# Altium schematic sheet ADC_8CH.SchDoc: ADC + reference
size 420 x 297 mm; Author: G.K.; CompanyName: WUT; DrawnBy: G.K.; Organization: CERN; Address1: Warsaw Univeristy of Technology; Address2: Nowowiejska 15/19; DocumentNumber: 2; Revision: -; SheetNumber: 2; SheetTotal: 5; EDA_Number: ARTIQ; Projet: 3U ADC (Sampler); ModifiedBy: -; CreateDate: XX/XX/XXXX; CheckedDate: -; Title2: v1.2; DivGrp: ISE; Designer: G.K.; ModifiedDate: -; ProjectName: 3U ADC (Sampler)
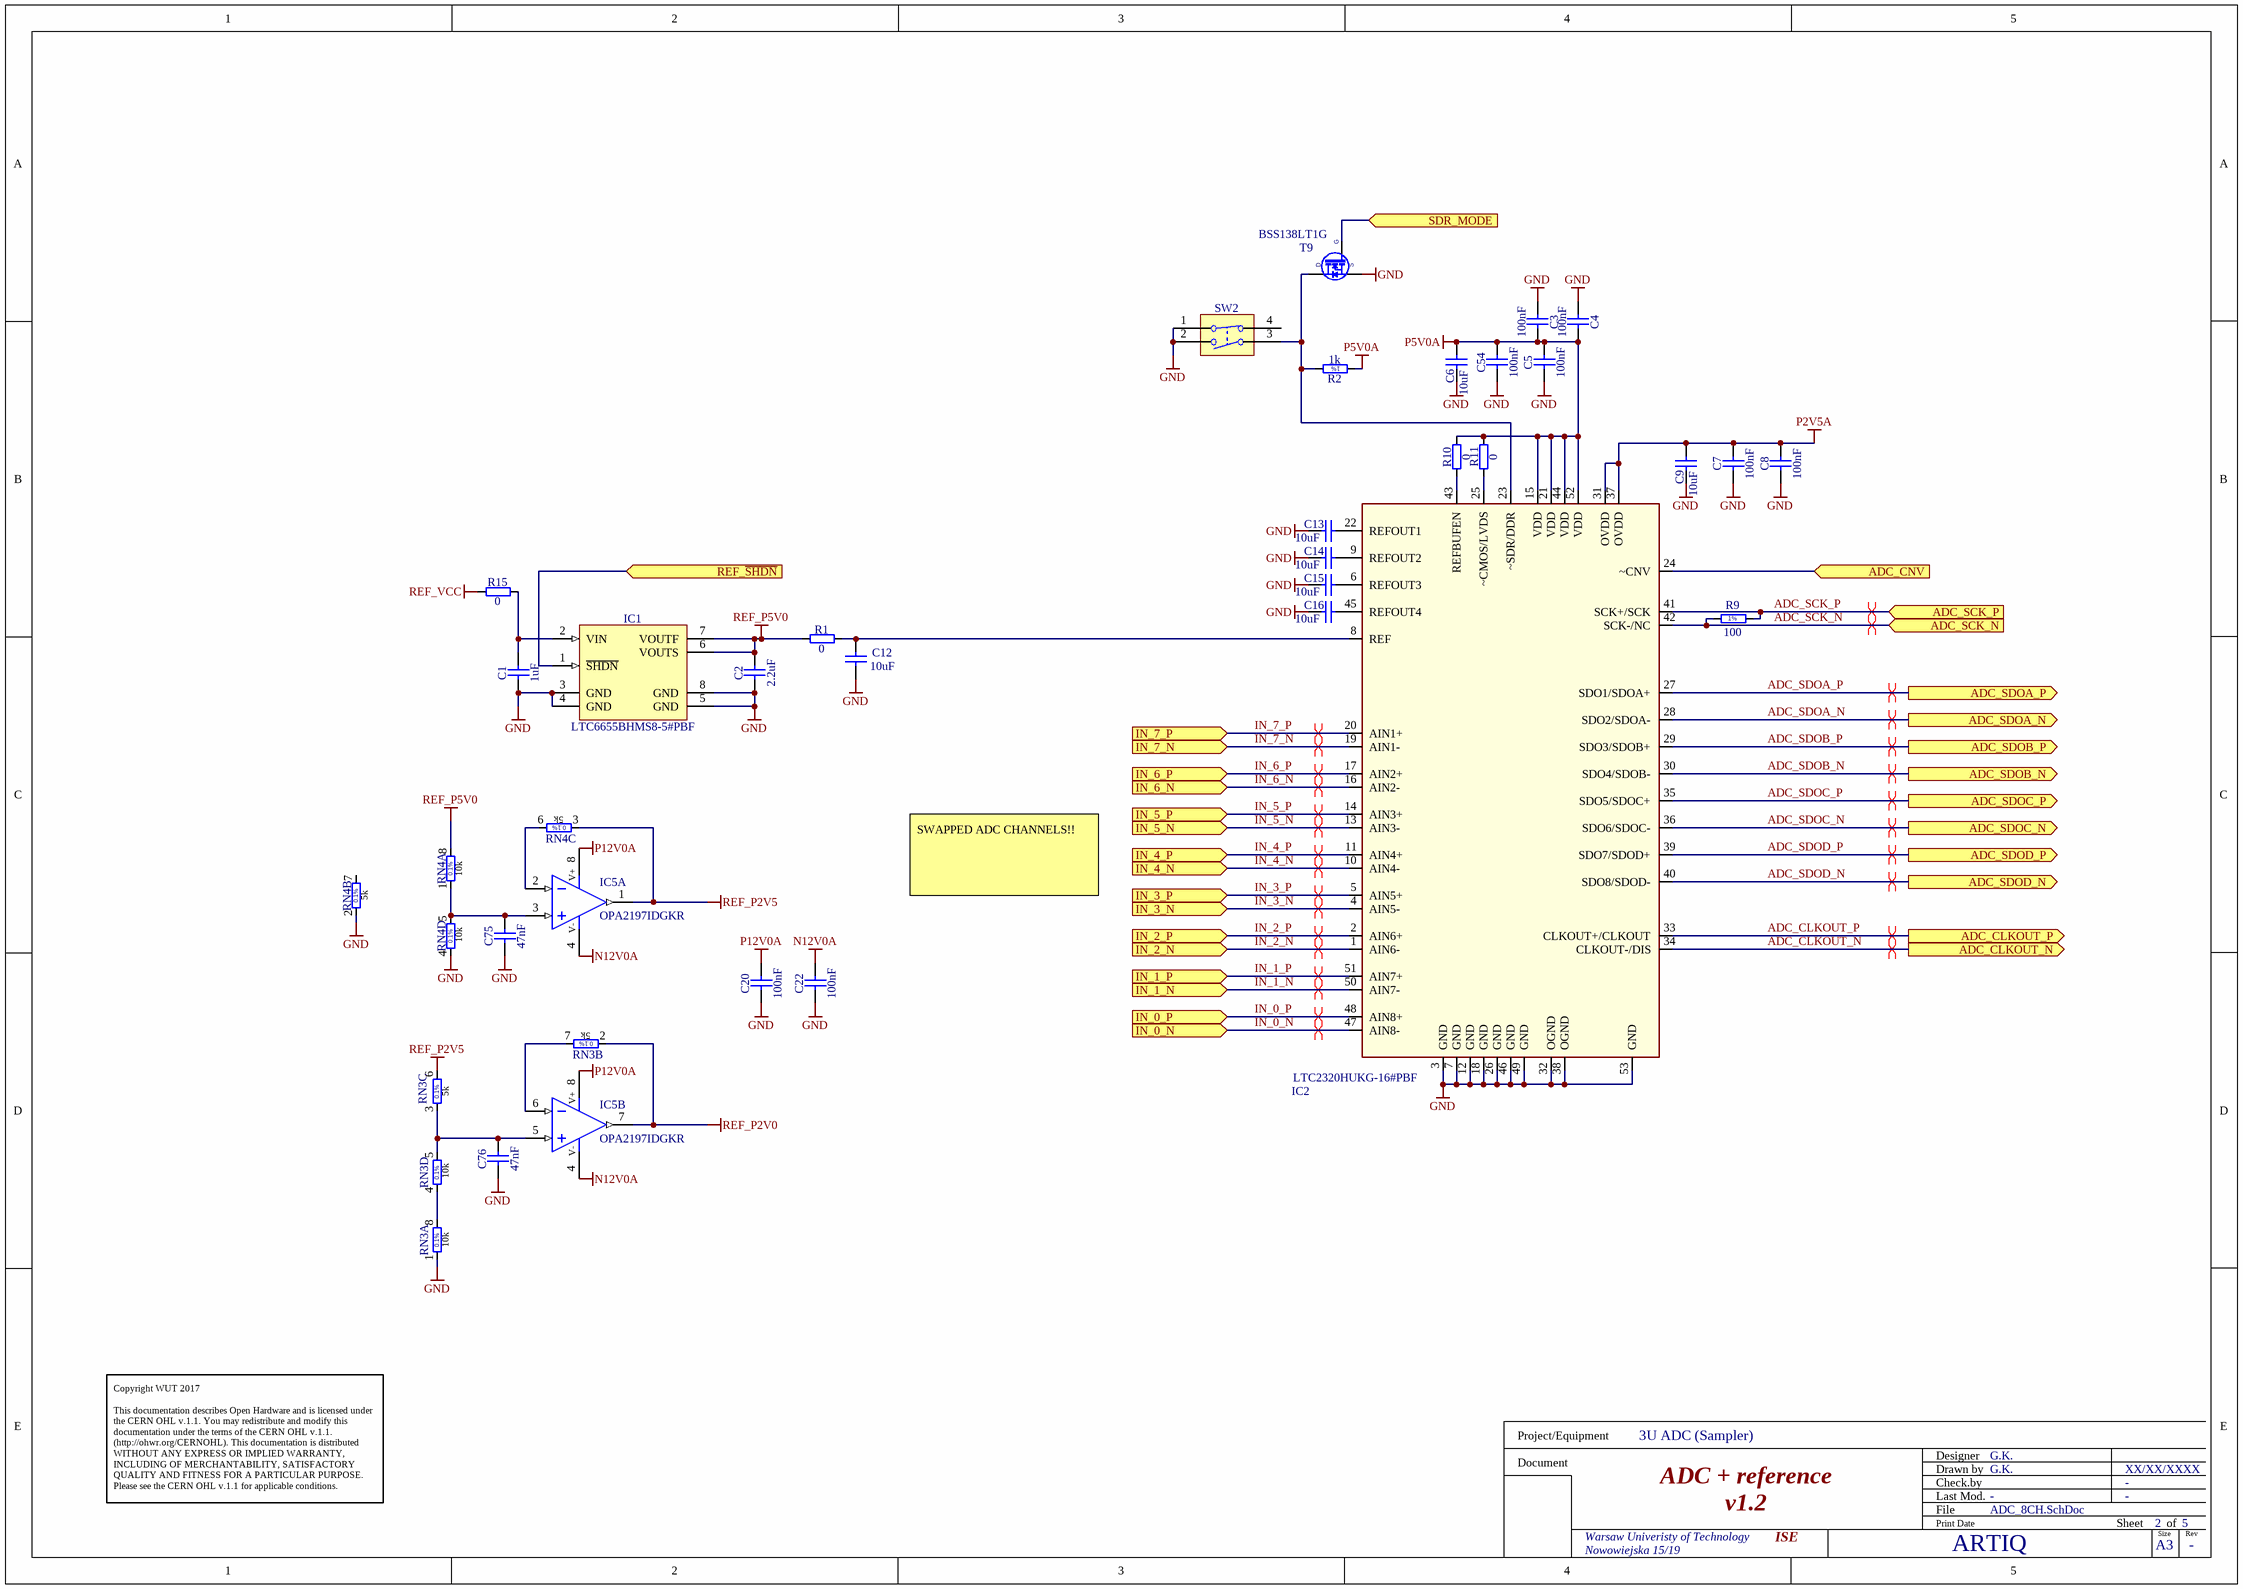
[diagram p0: ADC_8CH.SchDoc]

## Parts
C1  1uF  [CAPC1608X87N]
C2  2.2uF  [CAPC1608X87N]
C3  100nF  [CAPC1608X87N]
C4  100nF  [CAPC1608X87N]
C5  100nF  [CAPC1608X87N]
C6  10uF  [CAPC2012X95N]
C7  100nF  [CAPC1608X87N]
C8  100nF  [CAPC1608X87N]
C9  10uF  [CAPC2012X95N]
C12  10uF  [CAPC2012X95N]
C13  10uF  [CAPC2012X95N]
C14  10uF  [CAPC2012X95N]
C15  10uF  [CAPC2012X95N]
C16  10uF  [CAPC2012X95N]
C20  100nF  [CAPC1005X55N]
C22  100nF  [CAPC1005X55N]
C54  100nF  [CAPC1608X87N]
C75  47nF  [CAPC2012X135N]
C76  47nF  [CAPC2012X135N]
IC1  LTC6655BHMS8-5#PBF  [SOP65P490X110-8N]
IC2  LTC2320HUKG-16#PBF  [QFN50P700X800X80_HS-53M]
IC5  OPA2197IDGKR  [SOP65P490X110-8N]  (parts A,B of 2)
R1  0  [RESC1005X40N]
R2  1k  [RESC1608X55N]
R9  100  [RESC1005X40N]
R10  0  [RESC1005X40N]
R11  0  [RESC1005X40N]
R15  0  [RESC1005X40N]
RN3  10k 5K 5K 10K  [SOIC127P600X175-8N]  (value not drawn)  (parts A,B,C,D of 4)
RN4  10k 5K 5K 10K  [SOIC127P600X175-8N]  (value not drawn)  (parts A,B,C,D of 4)
SW2  Switch  [SW_CTS_204-121ST]  (value not drawn)
T9  BSS138LT1G  [SOT95P240X110-3N]

## Ports
ADC_CLKOUT_N (out), ADC_CLKOUT_P (out), ADC_CNV (in), ADC_SCK_N (in), ADC_SCK_P (in), ADC_SDOA_N (out), ADC_SDOA_P (out), ADC_SDOB_N (out), ADC_SDOB_P (out), ADC_SDOC_N (out), ADC_SDOC_P (out), ADC_SDOD_N (out), ADC_SDOD_P (out), IN_0_N (in), IN_0_P (in), IN_1_N (in), IN_1_P (in), IN_2_N (in), IN_2_P (in), IN_3_N (in), IN_3_P (in), IN_4_N (in), IN_4_P (in), IN_5_N (in), IN_5_P (in), IN_6_N (in), IN_6_P (in), IN_7_N (in), IN_7_P (in), REF_~{SHDN} (in), SDR_MODE (in)

## Nets
GND: C1.1 C2.1 C3.1 C4.1 C5.1 C6.1 C7.1 C8.1 C9.1 C12.1 C13.1 C14.1 C15.1 C16.1 C20.1 C22.1 C54.1 C75.1 C76.1 IC1.3(GND) IC1.4(GND) IC1.5(GND) IC1.8(GND) IC2.3(GND) IC2.7(GND) IC2.12(GND) IC2.18(GND) IC2.26(GND) IC2.32(OGND) IC2.38(OGND) IC2.46(GND) IC2.49(GND) IC2.53(GND) RN3.1 RN4.2 RN4.4 SW2.1 SW2.2 T9.2(S)
N12V0A: C22.2 IC5.4(V-)
P2V5A: C7.2 C8.2 C9.2 IC2.31(OVDD) IC2.37(OVDD)
P5V0A: C3.2 C4.2 C5.2 C6.2 C54.2 IC2.15(VDD) IC2.21(VDD) IC2.44(VDD) IC2.52(VDD) R2.1 R10.2 R11.2
P12V0A: C20.2 IC5.8(V+)
REF_P2V0: IC5.7(OUT) RN3.2
REF_P2V5: IC5.1(OUT) RN3.6 RN4.3
REF_P5V0: C2.2 IC1.6(VOUTS) IC1.7(VOUTF) R1.1 RN4.8
REF_VCC: R15.1
ADC_CLKOUT_N: IC2.34(CLKOUT-/DIS) ; port ADC_CLKOUT_N
ADC_CLKOUT_P: IC2.33(CLKOUT+/CLKOUT) ; port ADC_CLKOUT_P
ADC_CNV: IC2.24(~CNV) ; port ADC_CNV
ADC_SCK_N: IC2.42(SCK-/NC) R9.1 ; port ADC_SCK_N
ADC_SCK_P: IC2.41(SCK+/SCK) R9.2 ; port ADC_SCK_P
ADC_SDOA_N: IC2.28(SDO2/SDOA-) ; port ADC_SDOA_N
ADC_SDOA_P: IC2.27(SDO1/SDOA+) ; port ADC_SDOA_P
ADC_SDOB_N: IC2.30(SDO4/SDOB-) ; port ADC_SDOB_N
ADC_SDOB_P: IC2.29(SDO3/SDOB+) ; port ADC_SDOB_P
ADC_SDOC_N: IC2.36(SDO6/SDOC-) ; port ADC_SDOC_N
ADC_SDOC_P: IC2.35(SDO5/SDOC+) ; port ADC_SDOC_P
ADC_SDOD_N: IC2.40(SDO8/SDOD-) ; port ADC_SDOD_N
ADC_SDOD_P: IC2.39(SDO7/SDOD+) ; port ADC_SDOD_P
IN_0_N: IC2.47(AIN8-) ; port IN_0_N
IN_0_P: IC2.48(AIN8+) ; port IN_0_P
IN_1_N: IC2.50(AIN7-) ; port IN_1_N
IN_1_P: IC2.51(AIN7+) ; port IN_1_P
IN_2_N: IC2.1(AIN6-) ; port IN_2_N
IN_2_P: IC2.2(AIN6+) ; port IN_2_P
IN_3_N: IC2.4(AIN5-) ; port IN_3_N
IN_3_P: IC2.5(AIN5+) ; port IN_3_P
IN_4_N: IC2.10(AIN4-) ; port IN_4_N
IN_4_P: IC2.11(AIN4+) ; port IN_4_P
IN_5_N: IC2.13(AIN3-) ; port IN_5_N
IN_5_P: IC2.14(AIN3+) ; port IN_5_P
IN_6_N: IC2.16(AIN2-) ; port IN_6_N
IN_6_P: IC2.17(AIN2+) ; port IN_6_P
IN_7_N: IC2.19(AIN1-) ; port IN_7_N
IN_7_P: IC2.20(AIN1+) ; port IN_7_P
REF_~{SHDN}: IC1.1(~{SHDN}) ; port REF_~{SHDN}
SDR_MODE: T9.1(G) ; port SDR_MODE
NetC1_2: C1.2 IC1.2(VIN) R15.2
NetC12_2: C12.2 IC2.8(REF) R1.2
NetC13_2: C13.2 IC2.22(REFOUT1)
NetC14_2: C14.2 IC2.9(REFOUT2)
NetC15_2: C15.2 IC2.6(REFOUT3)
NetC16_2: C16.2 IC2.45(REFOUT4)
NetC75_2: C75.2 IC5.3(IN+) RN4.1 RN4.5
NetC76_2: C76.2 IC5.5(IN+) RN3.3 RN3.5
NetIC2_23: IC2.23(~SDR/DDR) R2.2 SW2.3 T9.3(D)
NetIC2_25: IC2.25(~CMOS/LVDS) R11.1
NetIC2_43: IC2.43(REFBUFEN) R10.1
NetIC5_2: IC5.2(IN-) RN4.6
NetIC5_6: IC5.6(IN-) RN3.7
NetRN3_4: RN3.4 RN3.8

Not connected (* = marked no-connect by the designer): RN4 7; SW2 4

## Layout directives
differential pair: ADC_CLKOUT_N, ADC_CLKOUT_P, ADC_SCK_N, ADC_SCK_P, ADC_SDOA_N, ADC_SDOA_P, ADC_SDOB_N, ADC_SDOB_P, ADC_SDOC_N, ADC_SDOC_P, ADC_SDOD_N, ADC_SDOD_P, IN_0_N, IN_0_P, IN_1_N, IN_1_P, IN_2_N, IN_2_P, IN_3_N, IN_3_P, IN_4_N, IN_4_P, IN_5_N, IN_5_P, IN_6_N, IN_6_P, IN_7_N, IN_7_P

## Notes on the sheet
- SWAPPED ADC CHANNELS!!
- Copyright WUT 2017
  This documentation describes Open Hardware and is licensed under the CERN OHL v.1.1. You may redistribute and modify this documentation under the terms of the CERN OHL v.1.1. (http://ohwr.org/CERNOHL). This documentation is distributed WITHOUT ANY EXPRESS OR IMPLIED WARRANTY, INCLUDING OF MERCHANTABILITY, SATISFACTORY QUALITY AND FITNESS FOR A PARTICULAR PURPOSE. Please see the CERN OHL v.1.1 for applicable conditions.
- Project/Equipment
- Document
- Designer
- Drawn by
- Check.by
- File
- Last Mod.
- Print Date
- Sheet
- Size
- A3
- of
- Rev
- (in symbol R0402_100R_1%_0.1W_100PPM) 1%
- (in symbol R0603_1K_1%_0.1W_100PPM) 1%
- (in symbol RN_10K_5K_VISHAY_AORN2-1AT3, part A) 10k
- (in symbol RN_10K_5K_VISHAY_AORN2-1AT3, part B) 5k
- (in symbol RN_10K_5K_VISHAY_AORN2-1AT3, part C) 5k
- (in symbol RN_10K_5K_VISHAY_AORN2-1AT3, part D) 10k

## Library data of the parts
C1 = CC0603_1UF_25V_10%_X7R: Non-polarised capacitor; Part Description: SMD Multilayer Chip Ceramic Capacitor; Manufacturer: GENERIC; Manufacturer1 Part Number: GRM188R71E105KA12D; Voltage: 25V; TC: X7R; Tolerance: ±10%; Part Number: CC0603_1UF_25V_10%_X7R; Component Kind: Standard; Component Type: Standard; Pin Count: 2; Value: 1uF; Status: None; Manufacturer Part Number: CC0603_1UF_25V_10%_X7R; Case: 0603; Mounted: Yes; Socket: No; SMD: Yes; Sense: No; Manufacturer1 Example: MURATA; Manufacturer1 ComponentHeight: 0.9mm; HelpURL: \\cern.ch\dfs\Applications\Altium\Datasheets\CC0603_X7R_MURATA.pdf; Author: CERN DEM JLC; CreateDate: 18.01.2011; LatestRevisionDate: 18.01.2011
C2 = CC0603_2.2UF_16V_10%_X5R: Non-polarised capacitor; Part Description: SMD Multilayer Chip Ceramic Capacitor; Manufacturer: GENERIC; Manufacturer1 Part Number: CC0603KRX5R7BB225; Voltage: 16V; TC: X5R; Tolerance: ±10%; Part Number: CC0603_2.2UF_16V_10%_X5R; Component Kind: Standard; Component Type: Standard; Pin Count: 2; Value: 2.2uF; Status: Preferred; Manufacturer Part Number: CC0603_2.2UF_16V_10%_X5R; Case: 0603; Mounted: Yes; Socket: No; SMD: Yes; Sense: No; Manufacturer1 Example: YAGEO; Manufacturer1 ComponentHeight: 0.9mm; HelpURL: \\cern.ch\dfs\Applications\Altium\Datasheets\CC0805_X5R_PHYCOMP_HC.pdf; Author: CERN DEM JLC; CreateDate: 28.04.2011; LatestRevisionDate: 28.04.2011
C3-C5 C7 C8 C54 = CC0603_100NF_50V_10%_X7R: Non-polarised capacitor; Part Description: SMD Multilayer Chip Ceramic Capacitor; Manufacturer: GENERIC; Manufacturer1 Part Number: 223858615649; Voltage: 50V; TC: X7R; Tolerance: ±10%; Part Number: CC0603_100NF_50V_10%_X7R; Component Kind: Standard; Component Type: Standard; Pin Count: 2; Value: 100nF; Status: Preferred; Manufacturer Part Number: CC0603_100NF_50V_10%_X7R; Case: 0603; Mounted: Yes; Socket: No; SMD: Yes; Sense: No; Manufacturer1 Example: PHYCOMP; Manufacturer1 ComponentHeight: 0.87mm; HelpURL: \\cern.ch\dfs\Applications\Altium\Datasheets\CC0603_X7R_PHYCOMP.pdf; Author: CERN DEM JLC; CreateDate: 03.12.2007; LatestRevisionDate: 03.12.2007
C6 C9 C12-C16 = CC0805_10UF_25V_10%_X5R: Non-polarised capacitor; Part Description: SMD Multilayer Chip Ceramic Capacitor; Manufacturer: GENERIC; Manufacturer1 Part Number: GRM219R61E106KA12D; Voltage: 25V; TC: X5R; Tolerance: ±10%; Part Number: CC0805_10UF_25V_10%_X5R; Component Kind: Standard; Component Type: Standard; Pin Count: 2; Value: 10uF; Status: Preferred; Manufacturer Part Number: CC0805_10UF_25V_10%_X5R; Case: 0805; Mounted: Yes; Socket: No; SMD: Yes; Sense: No; Manufacturer1 Example: MURATA; Manufacturer1 ComponentHeight: 0.95mm; HelpURL: \\cern.ch\dfs\Applications\Altium\Datasheets\CC0805_X5R_MURATA_GRM.pdf; Author: CERN DEM JLC; CreateDate: 25.10.2012; LatestRevisionDate: 06.09.2016
C20 C22 = CC0402_100NF_16V_10%_X5R: Non-polarised capacitor; Part Description: SMD Multilayer Chip Ceramic Capacitor; Manufacturer: GENERIC; Manufacturer1 Part Number: GRM155R61C104KA88D; Voltage: 16V; TC: X5R; Tolerance: ±10%; Part Number: CC0402_100NF_16V_10%_X5R; Component Kind: Standard; Component Type: Standard; Pin Count: 2; Value: 100nF; Status: None; Manufacturer Part Number: CC0402_100NF_16V_10%_X5R; Case: 0402; Mounted: Yes; Socket: No; SMD: Yes; Sense: No; Manufacturer1 Example: MURATA; Manufacturer1 ComponentHeight: 0.55mm; HelpURL: \\cern.ch\dfs\Applications\Altium\Datasheets\CC0402_X5R_MURATA_GRM.pdf; Author: CERN DEM JLC; CreateDate: 10.12.2013; LatestRevisionDate: 10.12.2013
C75 C76 = CC0805_47NF_25V_5%_C0G: Non-polarised capacitor; Part Description: SMD Multilayer Chip Ceramic Capacitor; Manufacturer: GENERIC; Manufacturer1 Part Number: C0805C473J3GACTU; Voltage: 25V; TC: C0G/NP0; Tolerance: ±5%; Part Number: CC0805_47NF_25V_5%_C0G; Component Kind: Standard; Component Type: Standard; Pin Count: 2; Value: 47nF; Status: None; Manufacturer Part Number: CC0805_47NF_25V_5%_C0G; Case: 0805; Mounted: Yes; Socket: No; SMD: Yes; Sense: No; Manufacturer1 Example: KEMET; Manufacturer1 ComponentHeight: 1.4mm; HelpURL: \\cern.ch\dfs\Applications\Altium\Datasheets\CC0805_C0G_KEMET_(Commercial Grade).pdf; Author: CERN DEM JLC; CreateDate: 18.01.2011; LatestRevisionDate: 18.01.2011
IC1 = LTC6655BHMS8-5#PBF: 0.25ppm Noise, Low Drift Precision Buffered Voltage Reference; Part Description: 5V, 0.25ppm Noise, Low Drift Precision Buffered Voltage Reference; Manufacturer: LINEAR TECHNOLOGY; PressFit: No; Bonding: No; Part Number: LTC6655BHMS8-5#PBF; Component Kind: Standard; Component Type: Standard; Device: LTC6655BHMS8-5#PBF; PackageDescription: SOP, 8-Leads, Body 3.1x3.1mm (max), Pitch 0.65mm, IPC Medium Density; Manufacturer Part Number: LTC6655BHMS8-5#PBF; Pin Count: 8; Case: SSOP8; Mounted: Yes; Socket: No; SMD: Yes; Sense: No; ComponentHeight: 1.1mm; HelpURL: \\cern.ch\dfs\Applications\Altium\Datasheets\LTC6655BHMS8-5#PBF.pdf; Author: CERN DEM JLC; CreateDate: 07.06.2012; LatestRevisionDate: 07.06.2012
IC2 = ADC_LTC2320HUKG-16: Octal, 16-Bit, 1.5Msps/Ch  Simultaneous Sampling ADC; Manufacturer: LINEAR TECHNOLOGY; PressFit: No; Bonding: No; Part Number: LTC2320HUKG-16#PBF; Component Kind: Standard; Component Type: Standard; Device: LTC2320HUKG-16#PBF; PackageDescription: QFN, 52-Leads, Body 7.00x8.00mm, Pitch 0.50mm, Thermal Pad 5.41x6.40mm, IPC Low Density; Part Description: Octal, 16-Bit, 1.5Msps/Ch  Simultaneous Sampling ADC; Manufacturer Part Number: LTC2320HUKG-16#PBF; Pin Count: 48; Case: QFP48; Mounted: Yes; Socket: No; SMD: Yes; Sense: No; ComponentHeight: 0.8; Author: GK; HelpURL: \\cern.ch\dfs\Applications\Altium\Datasheets\LTC2335CLX-18#PBF.pdf; CreateDate: 10.01.2017; LatestRevisionDate: 10.01.2017
IC5 = OA_OPA2197IDGKR: 36-V, Precision, Rail-to-Rail Input Output, Low Offset Voltage Op Amp 8-VSSOP; Part Description: High-Precision, Low-Noise, Rail-to-Rail Output,10-MHz Op Amp; Manufacturer: TEXAS INSTRUMENTS; PressFit: No; Bonding: No; Part Number: OPA2197IDGKR; Component Kind: Standard; Component Type: Standard; Device: OPA2197IDGKR; PackageDescription: SOP, 0.65mm pitch; 8 pin, 3.00mm W X 3.00mm L X 1.10mm H body, IPC Medium Density; Manufacturer Part Number: OPA2197IDGKR; Pin Count: 8; Case: MSOP8; Mounted: Yes; Socket: No; SMD: Yes; Sense: No; ComponentHeight: 1.1mm; Author: GK; HelpURL: \\cern.ch\dfs\Applications\Altium\Datasheets\OPA2140AIDGK.pdf; CreateDate: 20.04.2017; LatestRevisionDate: 20.04.2017
R1 R10 R11 R15 = R0402_0R_JUMPER: Resistor; Part Description: 1A (0.05R Max DC Resistance) Zero Ohm Jumper; Manufacturer: GENERIC; Manufacturer1 Part Number: 232270591001L; Part Number: R0402_0R_JUMPER; Component Kind: Standard; Component Type: Standard; Pin Count: 2; Value: 0; Status: Not recommended; Manufacturer Part Number: R0402_0R_JUMPER; Case: 0402; Mounted: Yes; Sense: No; Socket: No; SMD: Yes; Manufacturer1 Example: YAGEO PHYCOMP; Manufacturer1 ComponentHeight: 0.4mm; HelpURL: \\cern.ch\dfs\Applications\Altium\Datasheets\R0402_Phycomp_RC0402.pdf; Author: CERN DEM JLC; CreateDate: 03.12.2007; LatestRevisionDate: 17.10.2012
R2 = R0603_1K_1%_0.1W_100PPM: Resistor - 1%; Part Description: General Purpose Thick Film Chip Resistor; Manufacturer: GENERIC; Manufacturer1 Part Number: NRC06F1001TRF; Power: 0.1W; TC: ±100ppm/°C; Part Number: R0603_1K_1%_0.1W_100PPM; Component Kind: Standard; Component Type: Standard; Pin Count: 2; Value: 1k; Status: Preferred; Tolerance: ±1%; Manufacturer Part Number: R0603_1K_1%_0.1W_100PPM; Case: 0603; Mounted: Yes; Sense: No; Socket: No; SMD: Yes; Manufacturer1 Example: NIC COMPONENT; Manufacturer1 ComponentHeight: 0.55mm; HelpURL: \\cern.ch\dfs\Applications\Altium\Datasheets\R0603_NIC_NRC.pdf; Author: CERN DEM JLC; CreateDate: 03.12.2007; LatestRevisionDate: 13.03.2008
R9 = R0402_100R_1%_0.1W_100PPM: Resistor - 1%; Part Description: General Purpose Thick Film Chip Resistor; Manufacturer: GENERIC; Manufacturer Part Number: R0402_100R_1%_0.1W_100PPM_50V; Manufacturer1 Part Number: ERJ2RKF1000X; Power: 0.1W; TC: ±100ppm/°C; Voltage: 50V; Part Number: R0402_100R_1%_0.1W_100PPM; Component Kind: Standard; Component Type: Standard; Pin Count: 2; Value: 100; Status: Not recommended; Tolerance: ±1%; Case: 0402; Mounted: Yes; Sense: No; Socket: No; SMD: Yes; Manufacturer1 Example: PANASONIC; Manufacturer1 ComponentHeight: 0.4mm; HelpURL: \\cern.ch\dfs\Applications\Altium\Datasheets\R0402_PANASONIC_ERJ2RK.pdf; Author: CERN DEM JLC; CreateDate: 12.12.2013; LatestRevisionDate: 03.03.2015
RN3 RN4 = RN_10K_5K_VISHAY_AORN2-1AT3: DIL8 Resistor Network 4 Resistors 10k-5k-5k-10k 0.1%; Part Description: Dual-In-Line Thin Film Precision Automotive Resistors Network, (4 Isolated) - AORN Series; Manufacturer: VISHAY DALE; Power: 4x0.1W; TC: ±25ppm/°C; PressFit: No; Part Number: RN_10K_5K_VISHAY_AORN2-1AT3; Component Kind: Standard; Component Type: Standard; Pin Count: 8; Value: 10k 5K 5K 10K; Sense: No; Tolerance: 0.1%; Manufacturer Part Number: AORN2-1AT3; Case: SOIC8; Mounted: Yes; Socket: No; SMD: Yes; ComponentHeight: 1.73mm; HelpURL: \\cern.ch\dfs\Applications\Altium\Datasheets\RN_VISHAY_AORN.pdf; Author: CERN DEM JLC; CreateDate: 20.02.2017; LatestRevisionDate: 20.02.2017
SW2 = SW_CTS_204-121ST: 2x SPST DIP Switch 1NO + 1NF; Part Description: Coupled SPST DIP Switch, 1NO + 1NF, CTS 204 Series; Manufacturer: CTS; PressFit: No; Part Number: SW_CTS_204-121ST; Component Kind: Standard; Component Type: Standard; Pin Count: 4; PackageDescription: Body 7.26 x 9.78mm, 2x SPST DIP, 1NO + 1NF Switch, CTS 204 Series; Family: Switch; Mounted: Yes; Socket: No; SMD: Yes; Sense: No; Status: None; Manufacturer Part Number: 204-121ST; ComponentHeight: 10.36mm; HelpURL: \\cern.ch\dfs\Applications\Altium\Datasheets\SW_CTS_204-121ST.pdf; Author: CERN DEM JLC; CreateDate: 28.08.2014; LatestRevisionDate: 28.08.2014
T9 = BSS138LT1G: N-CHANNEL MOSFET WITH DIODE; Part Description: 50V 200mA N-Channel Enhancement Mode Field-Effect Transistor; Manufacturer: ON SEMICONDUCTOR; PressFit: No; Bonding: No; Part Number: BSS138LT1G; Component Kind: Standard; Component Type: Standard; Device: BSS138LT1G; PackageDescription: SOT23 3-Leads, Pitch 0.95mm - Body 1.4x3mm, IPC Medium Density; Manufacturer Part Number: BSS138LT1G; Pin Count: 3; Case: SOT23-3; Mounted: Yes; Socket: No; SMD: Yes; Sense: No; ComponentHeight: 1.11mm; HelpURL: \\cern.ch\dfs\Applications\Altium\Datasheets\BSS138LT1G.pdf; Author: CERN DEM JLC; CreateDate: 23.03.2009; LatestRevisionDate: 23.03.2009